# Altium schematic sheet Node_ADE.SchDoc
size Tabloid; SheetNumber: 1; SheetTotal: 1
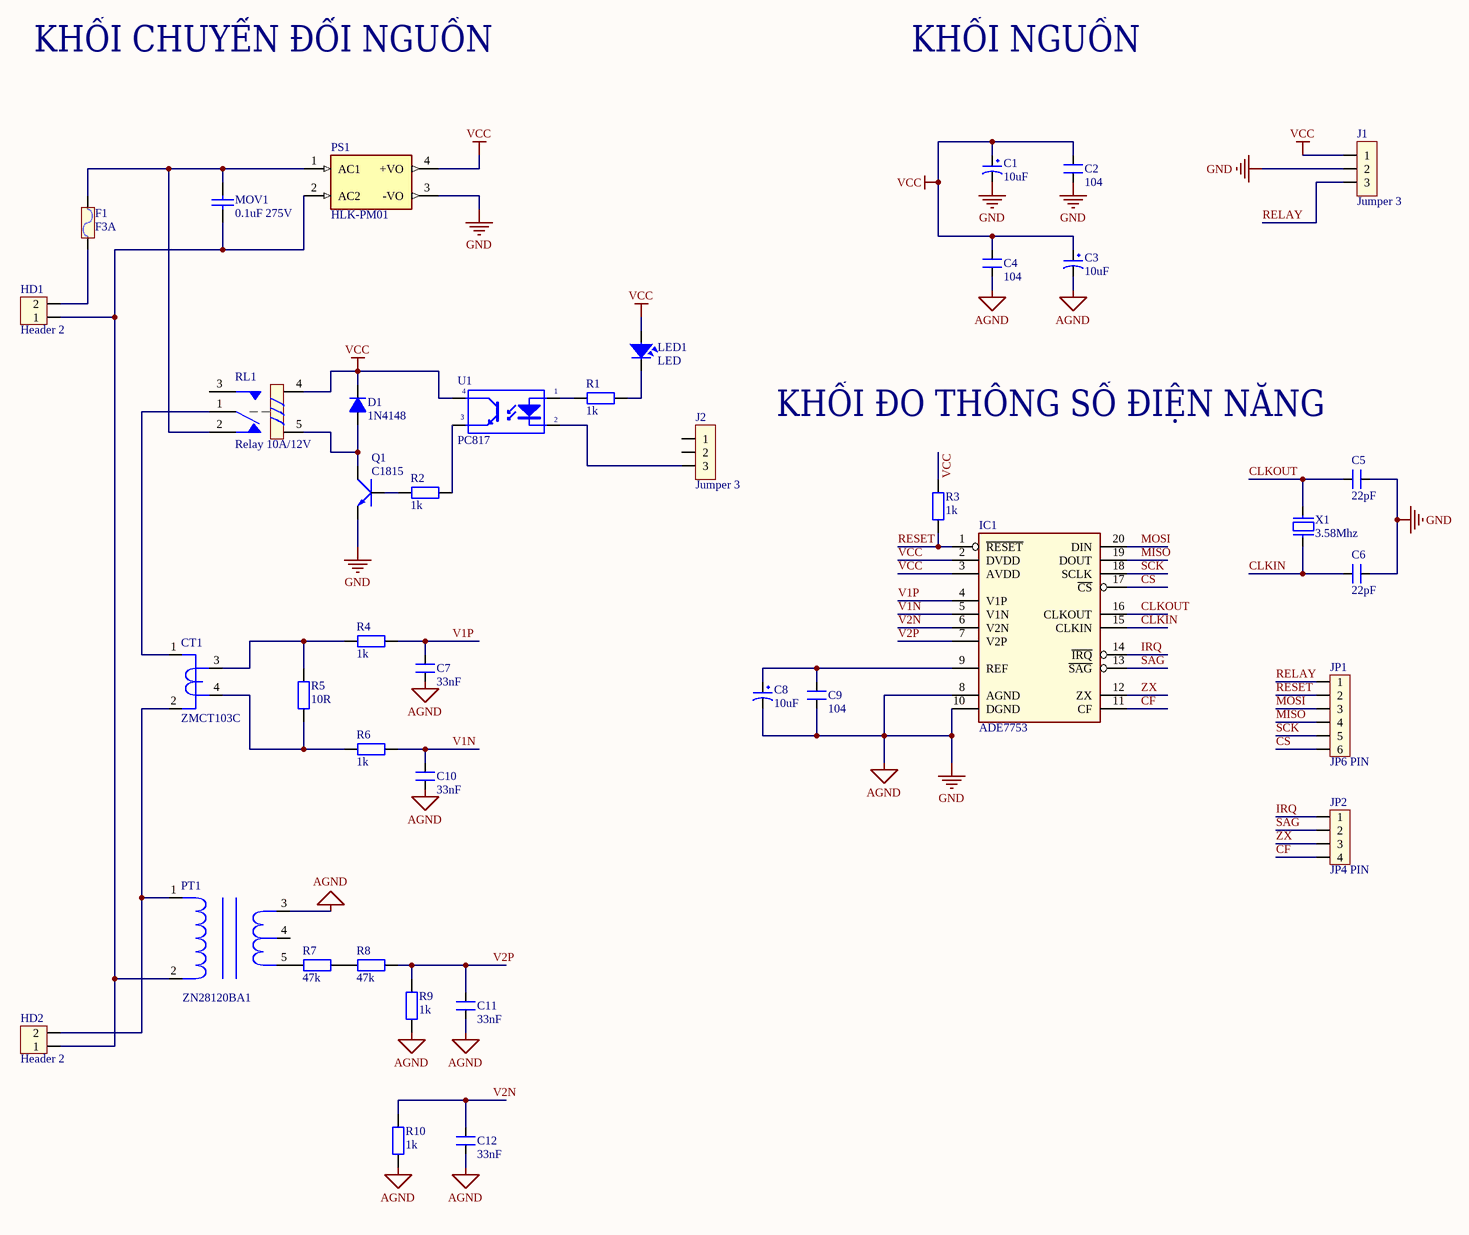
[diagram p0: Node_ADE.SchDoc]

## Parts
C1  10uF  [CP1/2]
C2  104  [CN2]
C3  10uF  [CP1/2]
C4  104  [CN2]
C5  22pF  [CN1]
C6  22pF  [CN1]
C7  33nF  [CN1]
C8  10uF  [CP1/2]
C9  104  [CN2]
C10  33nF  [CN1]
C11  33nF  [CN1]
C12  33nF  [CN1]
CT1  ZMCT103C  [ZMCT103C]
D1  1N4148  [D0.5A]
F1  F3A  [FUSE2]
HD1  Header 2  [HED2]
HD2  Header 2  [HED2]
IC1  ADE7753  [TSOP65-20BN]
J1  Jumper 3  [JP3]
J2  Jumper 3  [JP3]
JP1  JP6 PIN  [JP6]
JP2  JP4 PIN  [JP4]
LED1  LED  [LED-3]
MOV1  0.1uF 275V  [CAP_1uF]
PS1  HLK-PM01  [CONV_HLK-PM01]
PT1  ZN28120BA1  [ZN28120BA1]
Q1  C1815  [QTO-92]
R1  1k  [R1/4W]
R2  1k  [R1/4W]
R3  1k  [R1/4W]
R4  1k  [R1/4W]
R5  10R  [R1/2W]
R6  1k  [R1/4W]
R7  47k  [R1/4W]
R8  47k  [R1/4W]
R9  1k  [R1/4W]
R10  1k  [R1/4W]
RL1  Relay 10A/12V  [RL_SPDT_10A]
U1  PC817  [DIP4/W0.3]
X1  3.58Mhz  [XT2]

## Nets
AGND: C1.2 C2.1 C3.2 C4.1 C5.2 C6.2 C7.1 C8.2 C9.1 C10.1 C11.1 C12.1 IC1.8(AGND) IC1.10(DGND) J1.2 PS1.3(-VO) PT1.3 Q1.1(E) R9.1 R10.1  [also labelled GND]
VCC: C1.1 C2.2 C3.1 C4.2 D1.2(K) IC1.2(DVDD) IC1.3(AVDD) J1.1 LED1.1 PS1.4(+VO) R3.2 RL1.4 U1.4(C)
CF: IC1.11(CF) JP2.4
CLKIN: C6.1 IC1.15(CLKIN) X1.1
CLKOUT: C5.1 IC1.16(CLKOUT) X1.2
CS: IC1.17(~{CS}) JP1.6
IRQ: IC1.14(~{IRQ}) JP2.1
MISO: IC1.19(DOUT) JP1.4
MOSI: IC1.20(DIN) JP1.3
RELAY: J1.3 JP1.1
RESET: IC1.1(~{RESET}) JP1.2 R3.1
SAG: IC1.13(~{SAG}) JP2.2
SCK: IC1.18(SCLK) JP1.5
V1N: C10.2 IC1.5(V1N) R6.2
V1P: C7.2 IC1.4(V1P) R4.2
V2N: C12.2 IC1.6(V2N) R10.2
V2P: C11.2 IC1.7(V2P) R8.2 R9.2
ZX: IC1.12(ZX) JP2.3
NetC8_1: C8.1 C9.2 IC1.9(REF)
NetCT1_1: CT1.1 RL1.1
NetCT1_2: CT1.2 HD2.2 PT1.1
NetCT1_3: CT1.3 R4.1 R5.2
NetCT1_4: CT1.4 R5.1 R6.1
NetD1_1: D1.1(A) Q1.2(C) RL1.5
NetF1_1: F1.1 HD1.2
NetF1_2: F1.2 MOV1.1 PS1.1(AC1) RL1.2
NetHD1_1: HD1.1 HD2.1 MOV1.2 PS1.2(AC2) PT1.2
NetJ2_3: J2.3 U1.2(K)
NetLED1_2: LED1.2 R1.2
NetPT1_5: PT1.5 R7.1
NetQ1_3: Q1.3(B) R2.1
NetR1_1: R1.1 U1.1(A)
NetR2_2: R2.2 U1.3(E)
NetR7_2: R7.2 R8.1

Not connected (* = marked no-connect by the designer): J2 1 2; PT1 4; RL1 3

## Notes on the sheet
- KHỐI CHUYỂN ĐỔI NGUỒN
- KHỐI NGUỒN
- KHỐI ĐO THÔNG SỐ ĐIỆN NĂNG

## Library data of the parts
C1 C3 C8 = CP1: Cap P  0,1uF < 22uF , 16 - 50V; Value: 10uF/50V; Description 1: 10 => 220uF/6,3V/10V - 10uF => 100uF/16V; Description 2: 0,1uF => 33uF/50V - 10uF => 22uF/63V; Description 3: 0,47uF => 10uF/100V
C2 C4 C9 = CN2: Cap np 104 => 105pF; Value: 0.1uF
C5-C7 C10-C12 = CN0: Cremic For Xtal 1pF => 100pF; Value: 33pF
CT1 = ZMCT103C: ZMCT103C Current Transformer 1000:1 5A/5mA
D1 = D0.5A: Value: 1N4148
F1 = Fuse: Designed by: VanDungEvn; Value: Fuse
HD1 HD2 = Hed2: Header 2 (Green); Value: Header 2
IC1 = ADE7753: Single-Phase Multifunction Metering IC with di/dt Sensor Interface
J1 J2 = JP3: Value: J3
JP1 = JP6: Value: JP7
JP2 = JP4: Value: JP4
LED1 = LED: LED Single colour Green and Red; Value: LED 3 ly Single Colour
MOV1 = Cap DIP: Capacitor 0.1uF 275V; Value: 0.1uF
PS1 = HLK-PM01: The HLK-PM01 is a small size low cost AC to DC converter which can take in 110V/220V AC at 50/60 Hz and give 5V 3W output. The module is can be used in designs which run on 5V and needs to be powered form the AC mains.; MF: Hi-link; Package: None; Price: None; Value: *; SnapEDA_Link: https://www.snapeda.com/parts/hlk-pm01/Hi-link/view-part/?ref=snap; MP: hlk-pm01; Availability: Not in stock; Check_prices: https://www.snapeda.com/parts/hlk-pm01/Hi-link/view-part/?ref=eda
PT1 = EI28 ZN28120BA1: 220VAC / 12VAC EI28 ZN28120BA1
Q1 = C1815: NPN 600mW, ECB; Value: C1815
R1-R10 = R1/4W: Resistor 1/4W; Value: R1/4W - 1K
RL1 = Relay 1: Relay SPDT,10A - 12VDC 5 Pin; Value: Relay SPDT, 10A, 12V
U1 = PC817: Single Opto; Value: PC817
X1 = XT2: Crystal For all Crystal 2pin.; Value: 4Mhz